# Altium schematic sheet 保险丝作图.SchDoc
size A4
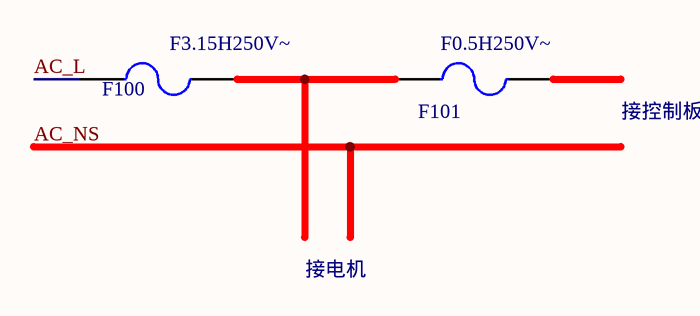
[diagram p0: 保险丝作图.SchDoc]

## Parts
F100  F3.15H250V~  [FUSE21.5*5.4-H-30]
F101  F0.5H250V~  [FUSE21.5*5.4-H-30]

## Nets
AC_L: F100.1
NetF100_2: F100.2 F101.1

Not connected (* = marked no-connect by the designer): F101 2

## Notes on the sheet
- 接控制板
- 接电机

## Library data of the parts
F100 F101 = Fuse 2: Published: 8-Jun-2000; LatestRevisionDate: 17-Jul-2002; LatestRevisionNote: Re-released for DXP Platform.; PackageReference: PIN-W2/E2.8; Publisher: Altium Limited; PackageDescription: Thru-Hole; 2 Leads